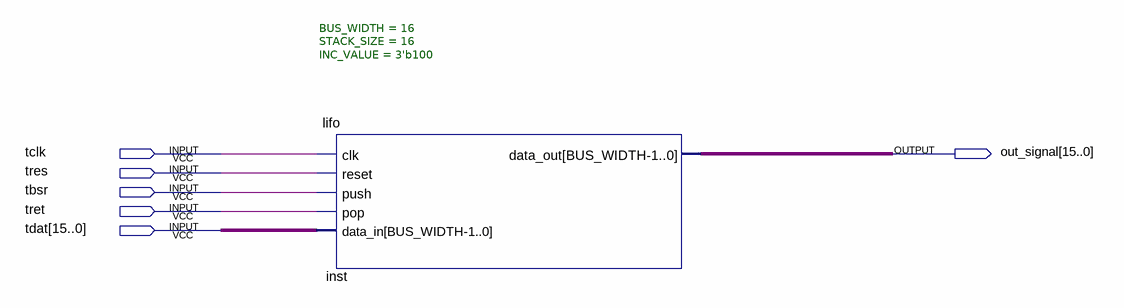
[diagram p0: schematic sheet]
// Quartus schematic stack_test.bdf as structural Verilog: 1 symbols, 6 pins
module stack_test (
  input  tclk,
  input  tres,
  input  tbsr,
  input  tret,
  input  [15:0] tdat,
  output [15:0] out_signal
);

  lifo #(.BUS_WIDTH(16), .STACK_SIZE(16), .INC_VALUE(3'b100)) inst (
    .clk(tclk), .reset(tres), .push(tbsr), .pop(tret), .data_in(tdat), .data_out(out_signal));
endmodule
